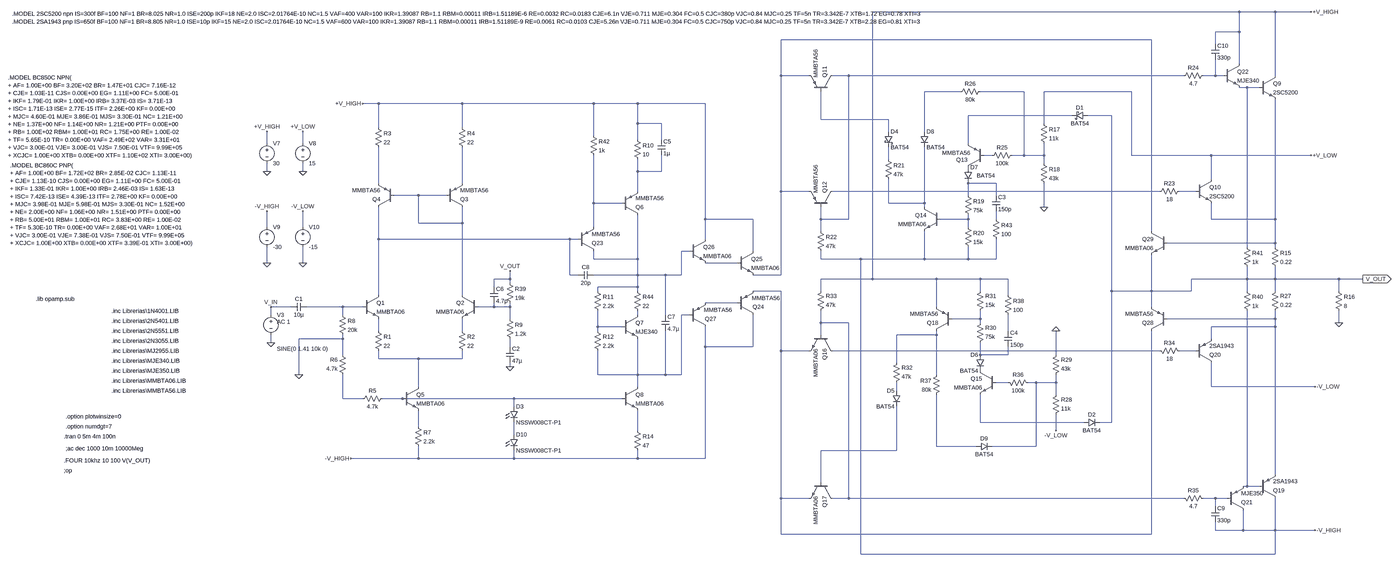
[diagram p0: schematic TPdisenio esquematico.asc, whole sheet]
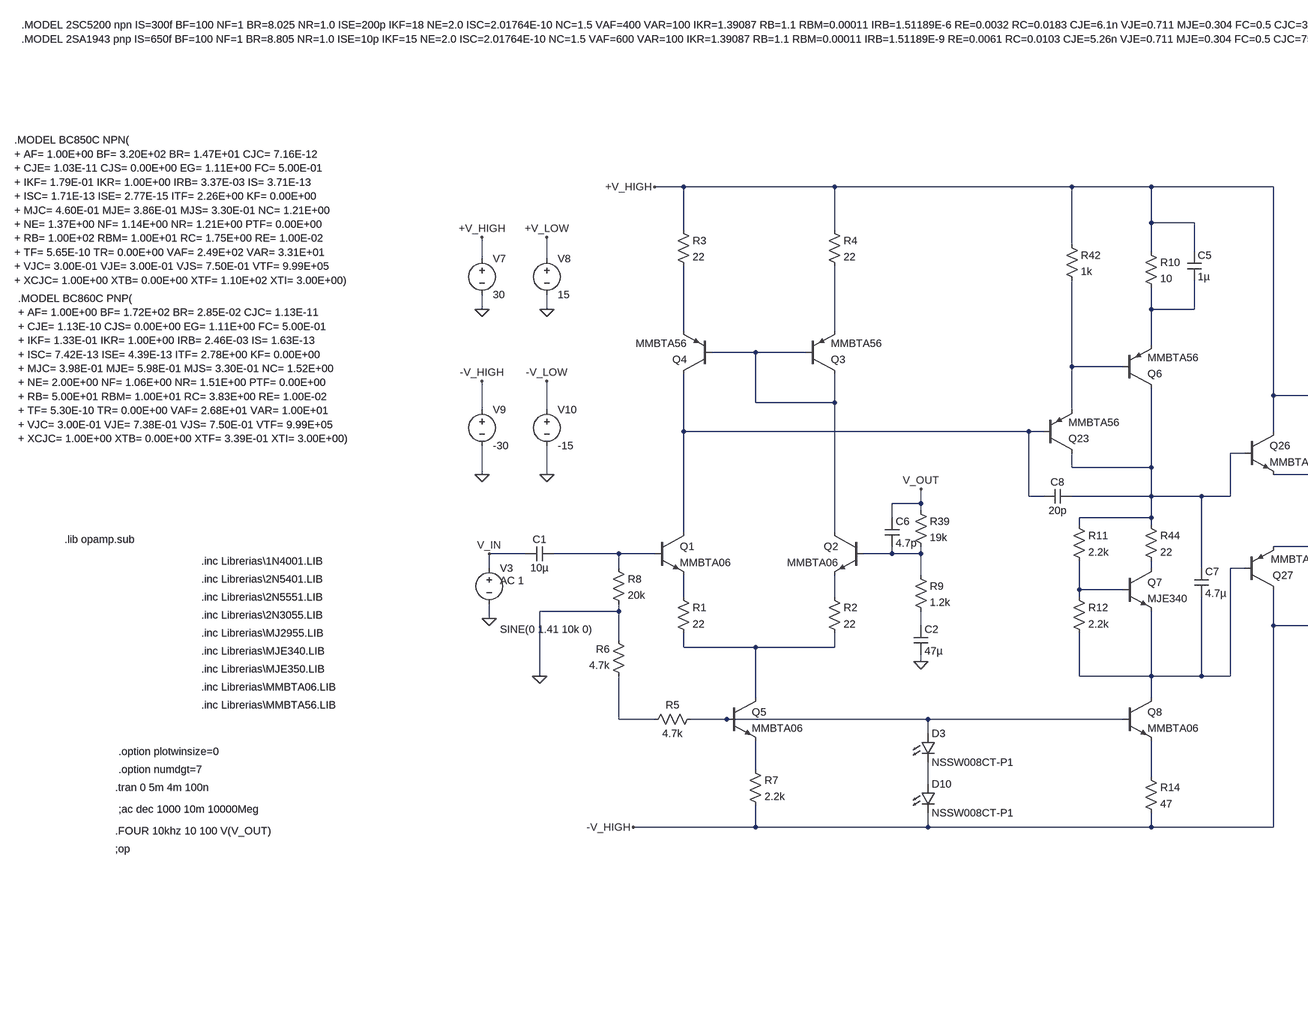
[diagram p1: schematic TPdisenio esquematico.asc, part, row 1 of 1, column 1 of 2]
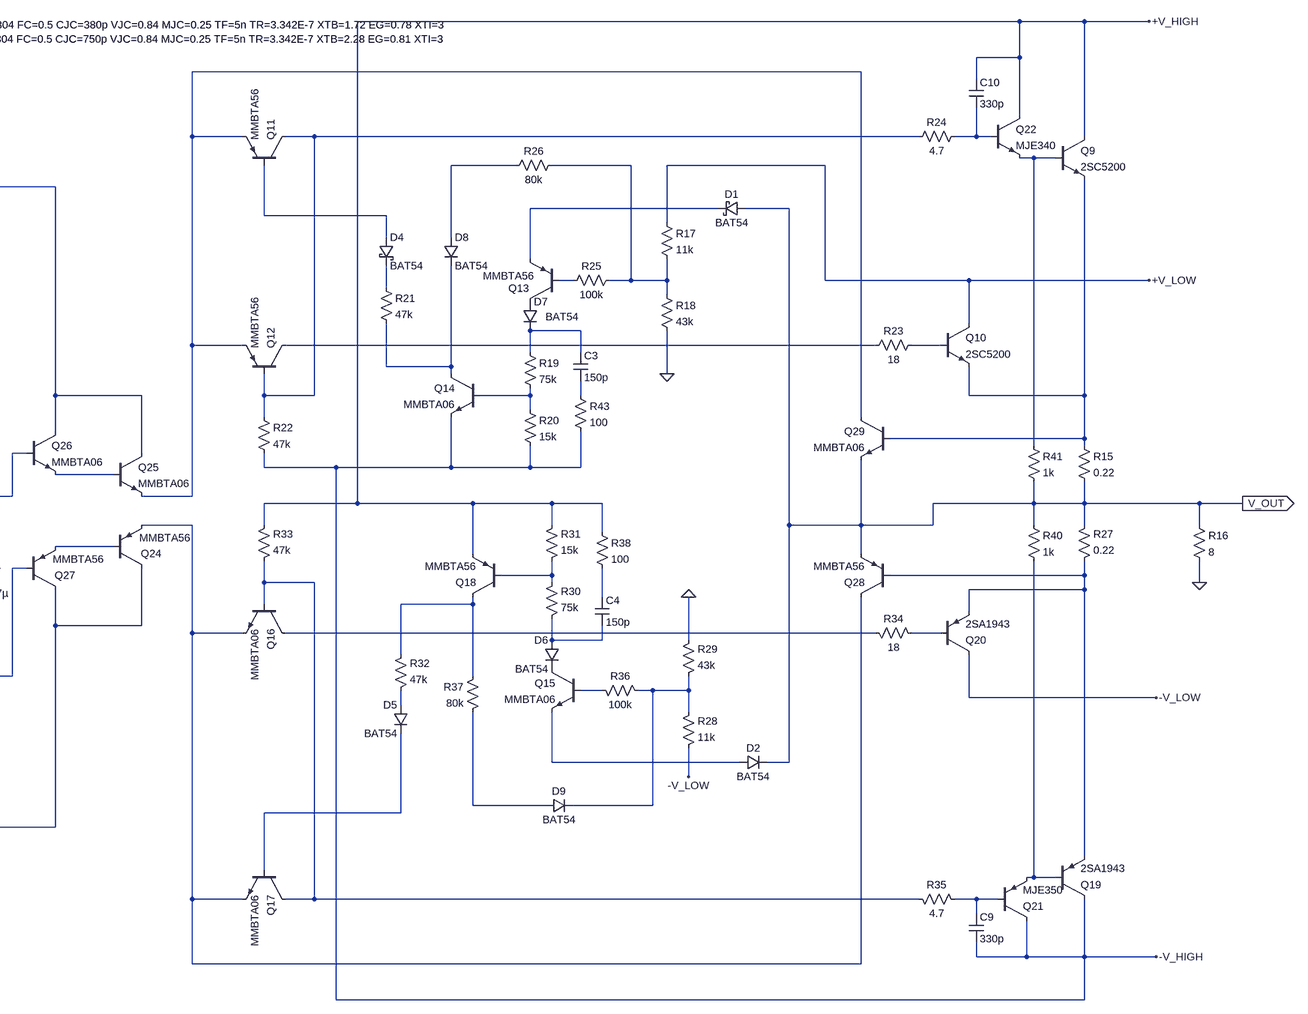
[diagram p2: schematic TPdisenio esquematico.asc, part, row 1 of 1, column 2 of 2]
TPdisenio esquematico.asc, the LTspice schematic file:
Version 4
SHEET 1 5784 2796
WIRE 3728 -992 2256 -992
WIRE 3872 -992 3728 -992
WIRE 4016 -992 3872 -992
WIRE 3728 -912 3728 -992
WIRE 3728 -912 3632 -912
WIRE 3376 -880 1888 -880
WIRE 3632 -864 3632 -912
WIRE 3728 -784 3728 -912
WIRE 1888 -736 1888 -880
WIRE 2000 -736 1888 -736
WIRE 2160 -736 2096 -736
WIRE 3504 -736 2160 -736
WIRE 3632 -736 3632 -800
WIRE 3632 -736 3584 -736
WIRE 3664 -736 3632 -736
WIRE 3872 -736 3872 -992
WIRE 3760 -688 3728 -688
WIRE 3808 -688 3760 -688
WIRE 2608 -672 2464 -672
WIRE 2864 -672 2688 -672
WIRE 3296 -672 2944 -672
WIRE 272 -624 208 -624
WIRE 608 -624 272 -624
WIRE 1136 -624 608 -624
WIRE 1312 -624 1136 -624
WIRE 1584 -624 1312 -624
WIRE 3056 -576 2640 -576
WIRE 3216 -576 3120 -576
WIRE 2048 -560 2048 -672
WIRE 2320 -560 2048 -560
WIRE 1312 -544 1312 -624
WIRE 1408 -544 1312 -544
WIRE 2944 -544 2944 -672
WIRE 272 -528 272 -624
WIRE 608 -528 608 -624
WIRE 2320 -512 2320 -560
WIRE 2464 -512 2464 -672
WIRE 1136 -496 1136 -624
WIRE 1312 -480 1312 -544
WIRE 1408 -480 1408 -544
WIRE -176 -464 -176 -512
WIRE -32 -464 -32 -512
WIRE 2640 -464 2640 -576
WIRE 2736 -416 2704 -416
WIRE 2864 -416 2864 -672
WIRE 2864 -416 2816 -416
WIRE 2944 -416 2944 -464
WIRE 2944 -416 2864 -416
WIRE 3296 -416 3296 -672
WIRE 3616 -416 3296 -416
WIRE 4016 -416 3616 -416
WIRE 2320 -400 2320 -448
WIRE 2944 -384 2944 -416
WIRE -176 -352 -176 -384
WIRE -32 -352 -32 -384
WIRE 1312 -352 1312 -400
WIRE 1408 -352 1408 -416
WIRE 1408 -352 1312 -352
WIRE 3616 -320 3616 -416
WIRE 272 -304 272 -448
WIRE 608 -304 608 -448
WIRE 2752 -304 2640 -304
WIRE 1312 -272 1312 -352
WIRE 1888 -272 1888 -736
WIRE 2000 -272 1888 -272
WIRE 3408 -272 2096 -272
WIRE 3552 -272 3488 -272
WIRE 432 -256 336 -256
WIRE 544 -256 432 -256
WIRE 2640 -256 2640 -304
WIRE 2752 -256 2752 -304
WIRE 1136 -224 1136 -416
WIRE 1248 -224 1136 -224
WIRE 2320 -224 2320 -320
WIRE 2464 -224 2464 -448
WIRE 2464 -224 2320 -224
WIRE 2464 -208 2464 -224
WIRE 2944 -208 2944 -304
WIRE 1584 -160 1584 -624
WIRE 1776 -160 1584 -160
WIRE 2048 -160 2048 -208
WIRE 2160 -160 2160 -736
WIRE 2160 -160 2048 -160
WIRE 2640 -160 2640 -176
WIRE 2640 -160 2528 -160
WIRE 2752 -160 2752 -192
WIRE 3616 -160 3616 -224
WIRE 3872 -160 3872 -640
WIRE 3872 -160 3616 -160
WIRE 432 -144 432 -256
WIRE 608 -144 608 -208
WIRE 608 -144 432 -144
WIRE -176 -128 -176 -192
WIRE -32 -128 -32 -192
WIRE 1136 -128 1136 -224
WIRE 2640 -128 2640 -160
WIRE 2048 -112 2048 -160
WIRE 3376 -112 3376 -880
WIRE 272 -80 272 -208
WIRE 1040 -80 272 -80
WIRE 1072 -80 1040 -80
WIRE 1584 -80 1584 -160
WIRE 3872 -64 3872 -160
WIRE 3872 -64 3440 -64
WIRE 3760 -48 3760 -688
WIRE 3872 -48 3872 -64
WIRE 1520 -32 1488 -32
WIRE 1776 -32 1776 -160
WIRE 1136 0 1136 -32
WIRE 1312 0 1312 -176
WIRE 1312 0 1136 0
WIRE 2048 0 2048 -32
WIRE 2208 0 2048 0
WIRE 2464 0 2464 -112
WIRE 2464 0 2208 0
WIRE 2640 0 2640 -48
WIRE 2640 0 2464 0
WIRE 2752 0 2752 -80
WIRE 2752 0 2640 0
WIRE -176 16 -176 -48
WIRE -32 16 -32 -48
WIRE 1712 16 1584 16
WIRE 1040 64 1040 -80
WIRE 1072 64 1040 64
WIRE 1312 64 1312 0
WIRE 1312 64 1136 64
WIRE 1424 64 1312 64
WIRE 1488 64 1488 -32
WIRE 1488 64 1424 64
WIRE 1888 64 1888 -272
WIRE 1888 64 1776 64
WIRE 800 80 800 48
WIRE 800 80 736 80
WIRE 2256 80 2256 -992
WIRE 2256 80 2048 80
WIRE 2512 80 2256 80
WIRE 2688 80 2512 80
WIRE 2800 80 2688 80
WIRE 3760 80 3760 32
WIRE 3760 80 3536 80
WIRE 3872 80 3872 32
WIRE 3872 80 3760 80
WIRE 4128 80 3872 80
WIRE 4224 80 4128 80
WIRE 800 96 800 80
WIRE 736 112 736 80
WIRE 1312 112 1312 64
WIRE 1312 112 1152 112
WIRE 1152 128 1152 112
WIRE 1312 128 1312 112
WIRE 1888 128 1776 128
WIRE 2048 128 2048 80
WIRE 2688 128 2688 80
WIRE 3216 128 3216 -576
WIRE 3376 128 3376 -16
WIRE 3376 128 3216 128
WIRE 3536 128 3536 80
WIRE 3536 128 3376 128
WIRE 3760 128 3760 80
WIRE 3872 128 3872 80
WIRE 4128 128 4128 80
WIRE 272 144 272 -80
WIRE 608 144 608 -144
WIRE 2800 144 2800 80
WIRE 1712 176 1584 176
WIRE -80 192 -160 192
WIRE 128 192 -16 192
WIRE 208 192 128 192
WIRE 736 192 736 176
WIRE 736 192 672 192
WIRE 800 192 800 176
WIRE 800 192 736 192
WIRE 2512 192 2512 80
WIRE 3376 192 3376 128
WIRE -160 224 -160 192
WIRE 128 224 128 192
WIRE 1312 224 1312 208
WIRE 1424 224 1424 64
WIRE 1520 224 1488 224
WIRE 800 240 800 192
WIRE 2688 240 2688 208
WIRE 2688 240 2576 240
WIRE 3872 240 3872 208
WIRE 3872 240 3440 240
WIRE 2048 256 2048 208
WIRE 2160 256 2048 256
WIRE 2688 256 2688 240
WIRE 4128 256 4128 208
WIRE 1152 272 1152 208
WIRE 1248 272 1152 272
WIRE 3872 272 3872 240
WIRE 3872 272 3616 272
WIRE 272 288 272 240
WIRE 608 288 608 240
WIRE 1152 288 1152 272
WIRE 2800 288 2800 224
WIRE 2048 304 2048 256
WIRE 2512 304 2512 288
WIRE 2512 304 2352 304
WIRE 128 320 128 304
WIRE 128 320 -48 320
WIRE 3616 320 3616 272
WIRE -160 336 -160 304
WIRE 800 352 800 320
WIRE 1584 352 1584 272
WIRE 1776 352 1776 224
WIRE 1776 352 1584 352
WIRE 1888 368 1888 128
WIRE 2000 368 1888 368
WIRE 3408 368 2096 368
WIRE 3552 368 3488 368
WIRE 128 384 128 320
WIRE 2688 384 2688 336
WIRE 2800 384 2800 352
WIRE 2800 384 2688 384
WIRE 2992 384 2992 288
WIRE 272 400 272 368
WIRE 432 400 272 400
WIRE 608 400 608 368
WIRE 608 400 432 400
WIRE 2352 416 2352 304
WIRE 800 432 800 416
WIRE -48 464 -48 320
WIRE 1152 464 1152 368
WIRE 1312 464 1312 320
WIRE 1312 464 1152 464
WIRE 1424 464 1424 288
WIRE 1424 464 1312 464
WIRE 1488 464 1488 224
WIRE 1488 464 1424 464
WIRE 2512 464 2512 304
WIRE 2800 496 2752 496
WIRE 2912 496 2880 496
WIRE 2992 496 2992 464
WIRE 2992 496 2912 496
WIRE 432 512 432 400
WIRE 1312 512 1312 464
WIRE 3616 512 3616 416
WIRE 4032 512 3616 512
WIRE 2352 528 2352 496
WIRE 2992 544 2992 496
WIRE 128 560 128 464
WIRE 208 560 128 560
WIRE 368 560 288 560
WIRE 816 560 368 560
WIRE 1248 560 816 560
WIRE 816 592 816 560
WIRE 2688 656 2688 544
WIRE 3104 656 2688 656
WIRE 3216 656 3216 128
WIRE 3216 656 3168 656
WIRE 432 672 432 608
WIRE 1312 688 1312 608
WIRE 2992 688 2992 624
WIRE 816 704 816 656
WIRE 2512 752 2512 544
WIRE 2672 752 2512 752
WIRE 2912 752 2912 496
WIRE 2912 752 2736 752
WIRE 2352 768 2352 592
WIRE 2352 768 2048 768
WIRE 432 800 432 752
WIRE 432 800 160 800
WIRE 816 800 816 768
WIRE 816 800 432 800
WIRE 1312 800 1312 768
WIRE 1312 800 816 800
WIRE 1584 800 1584 352
WIRE 1584 800 1312 800
WIRE 3872 864 3872 272
WIRE 2048 896 2048 768
WIRE 3760 912 3760 208
WIRE 3760 912 3744 912
WIRE 3808 912 3760 912
WIRE 1888 960 1888 368
WIRE 2000 960 1888 960
WIRE 2160 960 2160 256
WIRE 2160 960 2096 960
WIRE 3504 960 2160 960
WIRE 3632 960 3584 960
WIRE 3680 960 3632 960
WIRE 3632 992 3632 960
WIRE 3632 1088 3632 1056
WIRE 3744 1088 3744 1008
WIRE 3744 1088 3632 1088
WIRE 3872 1088 3872 960
WIRE 3872 1088 3744 1088
WIRE 4032 1088 3872 1088
WIRE 1888 1104 1888 960
WIRE 3376 1104 3376 288
WIRE 3376 1104 1888 1104
WIRE 2208 1184 2208 0
WIRE 3872 1184 3872 1088
WIRE 3872 1184 2208 1184
FLAG -48 464 0
FLAG 800 432 0
FLAG -160 336 0
FLAG 4016 -992 +V_HIGH
FLAG 4016 -416 +V_LOW
FLAG 4128 256 0
FLAG 2944 -208 0
FLAG 4224 80 V_OUT
IOPIN 4224 80 Out
FLAG 4032 1088 -V_HIGH
FLAG 4032 512 -V_LOW
FLAG 2992 288 0
FLAG 2992 688 -V_LOW
FLAG -176 -352 0
FLAG -32 -352 0
FLAG -176 -512 +V_HIGH
FLAG -32 -512 +V_LOW
FLAG -176 16 0
FLAG -32 16 0
FLAG -176 -192 -V_HIGH
FLAG -32 -192 -V_LOW
FLAG 208 -624 +V_HIGH
FLAG 160 800 -V_HIGH
FLAG 800 48 V_OUT
FLAG -160 192 V_IN
SYMBOL npn 208 144 R0
SYMATTR InstName Q1
SYMATTR Value MMBTA06
SYMBOL npn 672 144 M0
SYMATTR InstName Q2
SYMATTR Value MMBTA06
SYMBOL pnp 544 -208 M180
SYMATTR InstName Q3
SYMATTR Value MMBTA56
SYMBOL pnp 336 -208 R180
SYMATTR InstName Q4
SYMATTR Value MMBTA56
SYMBOL res 256 272 R0
SYMATTR InstName R1
SYMATTR Value 22
SYMBOL res 592 272 R0
SYMATTR InstName R2
SYMATTR Value 22
SYMBOL res 256 -544 R0
SYMATTR InstName R3
SYMATTR Value 22
SYMBOL res 592 -544 R0
SYMATTR InstName R4
SYMATTR Value 22
SYMBOL npn 368 512 R0
SYMATTR InstName Q5
SYMATTR Value MMBTA06
SYMBOL res 304 544 R90
WINDOW 0 0 56 VBottom 2
WINDOW 3 32 56 VTop 2
SYMATTR InstName R5
SYMATTR Value 4.7k
SYMBOL res 144 480 R180
WINDOW 0 36 76 Left 2
WINDOW 3 36 40 Left 2
SYMATTR InstName R6
SYMATTR Value 4.7k
SYMBOL res 416 656 R0
SYMATTR InstName R7
SYMATTR Value 2.2k
SYMBOL res 112 208 R0
SYMATTR InstName R8
SYMATTR Value 20k
SYMBOL res 784 224 R0
SYMATTR InstName R9
SYMATTR Value 1.2k
SYMBOL cap -16 176 R90
WINDOW 0 0 32 VBottom 2
WINDOW 3 32 32 VTop 2
SYMATTR InstName C1
SYMATTR Value 10µ
SYMBOL voltage -160 208 R0
WINDOW 3 24 152 Left 2
WINDOW 123 24 44 Left 2
WINDOW 39 0 0 Left 0
SYMATTR Value SINE(0 1.41 10k 0)
SYMATTR Value2 AC 1
SYMATTR InstName V3
SYMBOL pnp 1248 -176 M180
SYMATTR InstName Q6
SYMATTR Value MMBTA56
SYMBOL res 1296 -496 R0
SYMATTR InstName R10
SYMATTR Value 10
SYMBOL npn 1248 224 R0
SYMATTR InstName Q7
SYMATTR Value MJE340
SYMBOL res 1136 112 R0
SYMATTR InstName R11
SYMATTR Value 2.2k
SYMBOL res 1136 272 R0
SYMATTR InstName R12
SYMATTR Value 2.2k
SYMBOL npn 1248 512 R0
SYMATTR InstName Q8
SYMATTR Value MMBTA06
SYMBOL res 1296 672 R0
SYMATTR InstName R14
SYMATTR Value 47
SYMBOL cap 784 352 R0
SYMATTR InstName C2
SYMATTR Value 47µ
SYMBOL npn 3808 -736 R0
SYMATTR InstName Q9
SYMATTR Value 2SC5200
SYMBOL npn 3552 -320 R0
SYMATTR InstName Q10
SYMATTR Value 2SC5200
SYMBOL res 3856 -64 R0
SYMATTR InstName R15
SYMATTR Value 0.22
SYMBOL pnp 2096 -672 M270
SYMATTR InstName Q11
SYMATTR Value MMBTA56
SYMBOL pnp 2096 -208 M270
SYMATTR InstName Q12
SYMATTR Value MMBTA56
SYMBOL res 4112 112 R0
SYMATTR InstName R16
SYMATTR Value 8
SYMBOL res 2928 -560 R0
SYMATTR InstName R17
SYMATTR Value 11k
SYMBOL res 2928 -400 R0
SYMATTR InstName R18
SYMATTR Value 43k
SYMBOL pnp 2704 -368 R180
WINDOW 0 67 30 Left 2
WINDOW 3 55 58 Left 2
SYMATTR InstName Q13
SYMATTR Value MMBTA56
SYMBOL res 2624 -272 R0
SYMATTR InstName R19
SYMATTR Value 75k
SYMBOL res 2624 -144 R0
SYMATTR InstName R20
SYMATTR Value 15k
SYMBOL npn 2528 -208 M0
SYMATTR InstName Q14
SYMATTR Value MMBTA06
SYMBOL res 2304 -416 R0
SYMATTR InstName R21
SYMATTR Value 47k
SYMBOL res 2032 -128 R0
SYMATTR InstName R22
SYMATTR Value 47k
SYMBOL cap 2736 -256 R0
SYMATTR InstName C3
SYMATTR Value 150p
SYMBOL schottky 3120 -592 R90
WINDOW 0 0 32 VBottom 2
WINDOW 3 32 32 VTop 2
SYMATTR InstName D1
SYMATTR Value BAT54
SYMATTR Description Diode
SYMATTR Type diode
SYMBOL res 3504 -288 R90
WINDOW 0 0 56 VBottom 2
WINDOW 3 32 56 VTop 2
SYMATTR InstName R23
SYMATTR Value 18
SYMBOL res 3600 -752 R90
WINDOW 0 0 56 VBottom 2
WINDOW 3 32 56 VTop 2
SYMATTR InstName R24
SYMATTR Value 4.7
SYMBOL res 2832 -432 R90
WINDOW 0 0 56 VBottom 2
WINDOW 3 32 56 VTop 2
SYMATTR InstName R25
SYMATTR Value 100k
SYMBOL res 2704 -688 R90
WINDOW 0 0 56 VBottom 2
WINDOW 3 32 56 VTop 2
SYMATTR InstName R26
SYMATTR Value 80k
SYMBOL res 3856 224 M180
WINDOW 0 36 76 Left 2
WINDOW 3 36 40 Left 2
SYMATTR InstName R27
SYMATTR Value 0.22
SYMBOL res 2976 640 M180
WINDOW 0 36 76 Left 2
WINDOW 3 36 40 Left 2
SYMATTR InstName R28
SYMATTR Value 11k
SYMBOL res 2976 480 M180
WINDOW 0 36 76 Left 2
WINDOW 3 36 40 Left 2
SYMATTR InstName R29
SYMATTR Value 43k
SYMBOL res 2672 352 M180
WINDOW 0 36 76 Left 2
WINDOW 3 36 40 Left 2
SYMATTR InstName R30
SYMATTR Value 75k
SYMBOL res 2672 224 M180
WINDOW 0 36 76 Left 2
WINDOW 3 36 40 Left 2
SYMATTR InstName R31
SYMATTR Value 15k
SYMBOL res 2336 512 M180
WINDOW 0 36 76 Left 2
WINDOW 3 36 40 Left 2
SYMATTR InstName R32
SYMATTR Value 47k
SYMBOL res 2032 224 M180
WINDOW 0 36 76 Left 2
WINDOW 3 36 40 Left 2
SYMATTR InstName R33
SYMATTR Value 47k
SYMBOL cap 2784 352 M180
WINDOW 0 24 56 Left 2
WINDOW 3 24 8 Left 2
SYMATTR InstName C4
SYMATTR Value 150p
SYMBOL diode 3104 640 M90
WINDOW 0 0 32 VBottom 2
WINDOW 3 32 32 VTop 2
SYMATTR InstName D2
SYMATTR Value BAT54
SYMBOL res 3504 384 M270
WINDOW 0 32 56 VTop 2
WINDOW 3 0 56 VBottom 2
SYMATTR InstName R34
SYMATTR Value 18
SYMBOL res 3600 976 M270
WINDOW 0 32 56 VTop 2
WINDOW 3 0 56 VBottom 2
SYMATTR InstName R35
SYMATTR Value 4.7
SYMBOL res 2896 512 M270
WINDOW 0 32 56 VTop 2
WINDOW 3 0 56 VBottom 2
SYMATTR InstName R36
SYMATTR Value 100k
SYMBOL res 2528 448 M0
SYMATTR InstName R37
SYMATTR Value 80k
SYMBOL npn 2752 448 M0
SYMATTR InstName Q15
SYMATTR Value MMBTA06
SYMBOL npn 2096 304 R90
SYMATTR InstName Q16
SYMATTR Value MMBTA06
SYMBOL npn 2096 896 R90
SYMATTR InstName Q17
SYMATTR Value MMBTA06
SYMBOL pnp 2576 288 R180
SYMATTR InstName Q18
SYMATTR Value MMBTA56
SYMBOL pnp 3808 960 M180
SYMATTR InstName Q19
SYMATTR Value 2SA1943
SYMBOL pnp 3552 416 M180
SYMATTR InstName Q20
SYMATTR Value 2SA1943
SYMBOL voltage -176 -480 R0
WINDOW 123 0 0 Left 0
WINDOW 39 0 0 Left 0
SYMATTR InstName V7
SYMATTR Value 30
SYMBOL voltage -32 -480 R0
WINDOW 123 0 0 Left 0
WINDOW 39 0 0 Left 0
SYMATTR InstName V8
SYMATTR Value 15
SYMBOL voltage -176 -144 R0
WINDOW 123 0 0 Left 0
WINDOW 39 0 0 Left 0
SYMATTR InstName V9
SYMATTR Value -30
SYMBOL voltage -32 -144 R0
WINDOW 123 0 0 Left 0
WINDOW 39 0 0 Left 0
SYMATTR InstName V10
SYMATTR Value -15
SYMBOL res 784 80 R0
SYMATTR InstName R39
SYMATTR Value 19k
SYMBOL LED 800 592 R0
SYMATTR InstName D3
SYMATTR Value NSSW008CT-P1
SYMBOL cap 1392 -480 R0
SYMATTR InstName C5
SYMATTR Value 1µ
SYMBOL pnp 3680 1008 M180
SYMATTR InstName Q21
SYMATTR Value MJE350
SYMBOL res 3744 112 R0
SYMATTR InstName R40
SYMATTR Value 1k
SYMBOL npn 3664 -784 R0
SYMATTR InstName Q22
SYMATTR Value MJE340
SYMBOL res 3744 -64 R0
SYMATTR InstName R41
SYMATTR Value 1k
SYMBOL cap 720 112 R0
SYMATTR InstName C6
SYMATTR Value 4.7p
SYMBOL pnp 1072 -32 M180
SYMATTR InstName Q23
SYMATTR Value MMBTA56
SYMBOL res 1120 -512 R0
SYMATTR InstName R42
SYMATTR Value 1k
SYMBOL cap 1136 48 R90
WINDOW 0 0 32 VBottom 2
WINDOW 3 32 32 VTop 2
SYMATTR InstName C8
SYMATTR Value 20p
SYMBOL cap 1408 224 R0
SYMATTR InstName C7
SYMATTR Value 4.7µ
SYMBOL schottky 2304 -512 R0
SYMATTR InstName D4
SYMATTR Value BAT54
SYMATTR Description Diode
SYMATTR Type diode
SYMBOL diode 2368 528 M0
SYMATTR InstName D5
SYMATTR Value BAT54
SYMBOL diode 2704 384 M0
SYMATTR InstName D6
SYMATTR Value BAT54
SYMBOL diode 2624 -368 R0
WINDOW 3 50 33 Left 2
SYMATTR Value BAT54
SYMATTR InstName D7
SYMBOL diode 2448 -512 R0
SYMATTR InstName D8
SYMATTR Value BAT54
SYMBOL diode 2672 736 M90
WINDOW 0 0 32 VBottom 2
WINDOW 3 32 32 VTop 2
SYMATTR InstName D9
SYMATTR Value BAT54
SYMBOL pnp 1712 224 M180
WINDOW 0 62 32 Left 2
WINDOW 3 59 67 Left 2
SYMATTR InstName Q24
SYMATTR Value MMBTA56
SYMBOL npn 1712 -32 R0
SYMATTR InstName Q25
SYMATTR Value MMBTA06
SYMBOL npn 1520 -80 R0
SYMATTR InstName Q26
SYMATTR Value MMBTA06
SYMBOL pnp 1520 272 M180
WINDOW 0 62 32 Left 2
WINDOW 3 58 68 Left 2
SYMATTR InstName Q27
SYMATTR Value MMBTA56
SYMBOL res 1296 112 R0
SYMATTR InstName R44
SYMATTR Value 22
SYMBOL pnp 3440 288 R180
SYMATTR InstName Q28
SYMATTR Value MMBTA56
SYMBOL npn 3440 -112 M0
SYMATTR InstName Q29
SYMATTR Value MMBTA06
SYMBOL res 2784 128 R0
SYMATTR InstName R38
SYMATTR Value 100
SYMBOL res 2736 -176 R0
SYMATTR InstName R43
SYMATTR Value 100
SYMBOL cap 3616 992 R0
SYMATTR InstName C9
SYMATTR Value 330p
SYMBOL cap 3616 -864 R0
SYMATTR InstName C10
SYMATTR Value 330p
SYMBOL LED 800 704 R0
SYMATTR InstName D10
SYMATTR Value NSSW008CT-P1
TEXT -992 712 Left 2 !.tran 0 5m 4m 100n
TEXT -992 808 Left 2 !.FOUR 10khz 10 100 V(V_OUT)
TEXT -1216 -728 Left 2 !.MODEL BC850C NPN(\n+ AF= 1.00E+00 BF= 3.20E+02 BR= 1.47E+01 CJC= 7.16E-12\n+ CJE= 1.03E-11 CJS= 0.00E+00 EG= 1.11E+00 FC= 5.00E-01\n+ IKF= 1.79E-01 IKR= 1.00E+00 IRB= 3.37E-03 IS= 3.71E-13\n+ ISC= 1.71E-13 ISE= 2.77E-15 ITF= 2.26E+00 KF= 0.00E+00\n+ MJC= 4.60E-01 MJE= 3.86E-01 MJS= 3.30E-01 NC= 1.21E+00\n+ NE= 1.37E+00 NF= 1.14E+00 NR= 1.21E+00 PTF= 0.00E+00\n+ RB= 1.00E+02 RBM= 1.00E+01 RC= 1.75E+00 RE= 1.00E-02\n+ TF= 5.65E-10 TR= 0.00E+00 VAF= 2.49E+02 VAR= 3.31E+01\n+ VJC= 3.00E-01 VJE= 3.00E-01 VJS= 7.50E-01 VTF= 9.99E+05\n+ XCJC= 1.00E+00 XTB= 0.00E+00 XTF= 1.10E+02 XTI= 3.00E+00)
TEXT -1208 -376 Left 2 !.MODEL BC860C PNP(\n+ AF= 1.00E+00 BF= 1.72E+02 BR= 2.85E-02 CJC= 1.13E-11\n+ CJE= 1.13E-10 CJS= 0.00E+00 EG= 1.11E+00 FC= 5.00E-01\n+ IKF= 1.33E-01 IKR= 1.00E+00 IRB= 2.46E-03 IS= 1.63E-13\n+ ISC= 7.42E-13 ISE= 4.39E-13 ITF= 2.78E+00 KF= 0.00E+00\n+ MJC= 3.98E-01 MJE= 5.98E-01 MJS= 3.30E-01 NC= 1.52E+00\n+ NE= 2.00E+00 NF= 1.06E+00 NR= 1.51E+00 PTF= 0.00E+00\n+ RB= 5.00E+01 RBM= 1.00E+01 RC= 3.83E+00 RE= 1.00E-02\n+ TF= 5.30E-10 TR= 0.00E+00 VAF= 2.68E+01 VAR= 1.00E+01\n+ VJC= 3.00E-01 VJE= 7.38E-01 VJS= 7.50E-01 VTF= 9.99E+05\n+ XCJC= 1.00E+00 XTB= 0.00E+00 XTF= 3.39E-01 XTI= 3.00E+00)
TEXT -1104 160 Left 2 !.lib opamp.sub
TEXT -984 760 Left 2 !;ac dec 1000 10m 10000Meg
TEXT -992 848 Left 2 !;op
TEXT -984 672 Left 2 !.option numdgt=7
TEXT -984 632 Left 2 !.option plotwinsize=0
TEXT -1200 -984 Left 2 !.MODEL 2SC5200 npn IS=300f BF=100 NF=1 BR=8.025 NR=1.0 ISE=200p IKF=18 NE=2.0 ISC=2.01764E-10 NC=1.5 VAF=400 VAR=100 IKR=1.39087 RB=1.1 RBM=0.00011 IRB=1.51189E-6 RE=0.0032 RC=0.0183 CJE=6.1n VJE=0.711 MJE=0.304 FC=0.5 CJC=380p VJC=0.84 MJC=0.25 TF=5n TR=3.342E-7 XTB=1.72 EG=0.78 XTI=3\n.MODEL 2SA1943 pnp IS=650f BF=100 NF=1 BR=8.805 NR=1.0 ISE=10p IKF=15 NE=2.0 ISC=2.01764E-10 NC=1.5 VAF=600 VAR=100 IKR=1.39087 RB=1.1 RBM=0.00011 IRB=1.51189E-9 RE=0.0061 RC=0.0103 CJE=5.26n VJE=0.711 MJE=0.304 FC=0.5 CJC=750p VJC=0.84 MJC=0.25 TF=5n TR=3.342E-7 XTB=2.28 EG=0.81 XTI=3
TEXT -800 368 Left 2 !.inc Librerias\\MJ2955.LIB
TEXT -800 328 Left 2 !.inc Librerias\\2N3055.LIB
TEXT -800 288 Left 2 !.inc Librerias\\2N5551.LIB
TEXT -800 248 Left 2 !.inc Librerias\\2N5401.LIB
TEXT -800 208 Left 2 !.inc Librerias\\1N4001.LIB
TEXT -800 408 Left 2 !.inc Librerias\\MJE340.LIB
TEXT -800 448 Left 2 !.inc Librerias\\MJE350.LIB
TEXT -800 488 Left 2 !.inc Librerias\\MMBTA06.LIB
TEXT -800 528 Left 2 !.inc Librerias\\MMBTA56.LIB

The netlist it stands for:
* TPdisenio esquematico.asc
Q1 N023 N028 N036 0 MMBTA06
Q2 N017 N029 N037 0 MMBTA06
Q3 N017 N017 N013 0 MMBTA56
Q4 N023 N017 N012 0 MMBTA56
R1 N036 N044 22
R2 N037 N044 22
R3 +V_HIGH N012 22
R4 +V_HIGH N013 22
Q5 N044 N049 N051 0 MMBTA06
R5 N049 N048 4.7k
R6 N048 0 4.7k
R7 N051 -V_HIGH 2.2k
R8 N028 0 20k
R9 N029 N040 1.2k
C1 N028 V_IN 10µ
V3 V_IN 0 SINE(0 1.41 10k 0) AC 1
Q6 N024 N018 N011 0 MMBTA56
R10 +V_HIGH N011 10
Q7 N030 N035 N031 0 MJE340
R11 N024 N035 2.2k
R12 N035 N031 2.2k
Q8 N031 N049 N052 0 MMBTA06
R14 N052 -V_HIGH 47
C2 N040 0 47µ
Q9 +V_HIGH N004 N022 0 2SC5200
Q10 +V_LOW N016 N022 0 2SC5200
R15 N022 V_OUT 0.22
Q11 N002 N008 N001 0 MMBTA56
Q12 N015 N002 N001 0 MMBTA56
R16 V_OUT 0 8
R17 +V_LOW N006 11k
R18 N006 0 43k
Q13 P001 N009 N007 0 MMBTA56
R19 N014 N020 75k
R20 N020 -V_HIGH 15k
Q14 N019 N020 -V_HIGH 0 MMBTA06
R21 N010 N019 47k
R22 N002 -V_HIGH 47k
C3 N014 N021 150p
D1 V_OUT N007 BAT54
R23 N016 N015 18
R24 N003 N002 4.7
R25 N006 N009 100k
R26 N006 N005 80k
R27 N033 V_OUT 0.22
R28 -V_LOW N046 11k
R29 N046 0 43k
R30 N043 N032 75k
R31 N032 +V_HIGH 15k
R32 N047 N039 47k
R33 N034 +V_HIGH 47k
C4 N043 N038 150p
D2 N050 V_OUT BAT54
R34 N042 N041 18
R35 N057 N034 4.7
R36 N046 N045 100k
R37 N039 N054 80k
Q15 P002 N045 N050 0 MMBTA06
Q16 N041 N034 N026 0 MMBTA06
Q17 N034 N055 N026 0 MMBTA06
Q18 N039 N032 +V_HIGH 0 MMBTA56
Q19 -V_HIGH N056 N033 0 2SA1943
Q20 -V_LOW N042 N033 0 2SA1943
V7 +V_HIGH 0 30
V8 +V_LOW 0 15
V9 -V_HIGH 0 -30
V10 -V_LOW 0 -15
R39 V_OUT N029 19k
D3 N049 N053 NSSW008CT-P1
C5 +V_HIGH N011 1µ
Q21 -V_HIGH N057 N056 0 MJE350
R40 V_OUT N056 1k
Q22 +V_HIGH N003 N004 0 MJE340
R41 N004 V_OUT 1k
C6 V_OUT N029 4.7p
Q23 N024 N023 N018 0 MMBTA56
R42 +V_HIGH N018 1k
C8 N024 N023 20p
C7 N024 N031 4.7µ
D4 N008 N010 BAT54
D5 N047 N055 BAT54
D6 N043 P002 BAT54
D7 P001 N014 BAT54
D8 N005 N019 BAT54
D9 N054 N046 BAT54
Q24 -V_HIGH N027 N026 0 MMBTA56
Q25 +V_HIGH N025 N001 0 MMBTA06
Q26 +V_HIGH N024 N025 0 MMBTA06
Q27 -V_HIGH N031 N027 0 MMBTA56
R44 N024 N030 22
Q28 N026 N033 V_OUT 0 MMBTA56
Q29 N001 N022 V_OUT 0 MMBTA06
R38 +V_HIGH N038 100
R43 N021 -V_HIGH 100
C9 N057 -V_HIGH 330p
C10 +V_HIGH N003 330p
D10 N053 -V_HIGH NSSW008CT-P1
.model D D
.lib standard.dio
.model NPN NPN
.model PNP PNP
.lib standard.bjt
.tran 0 5m 4m 100n
.FOUR 10khz 10 100 V(V_OUT)
.MODEL BC850C NPN(
+ AF= 1.00E+00 BF= 3.20E+02 BR= 1.47E+01 CJC= 7.16E-12
+ CJE= 1.03E-11 CJS= 0.00E+00 EG= 1.11E+00 FC= 5.00E-01
+ IKF= 1.79E-01 IKR= 1.00E+00 IRB= 3.37E-03 IS= 3.71E-13
+ ISC= 1.71E-13 ISE= 2.77E-15 ITF= 2.26E+00 KF= 0.00E+00
+ MJC= 4.60E-01 MJE= 3.86E-01 MJS= 3.30E-01 NC= 1.21E+00
+ NE= 1.37E+00 NF= 1.14E+00 NR= 1.21E+00 PTF= 0.00E+00
+ RB= 1.00E+02 RBM= 1.00E+01 RC= 1.75E+00 RE= 1.00E-02
+ TF= 5.65E-10 TR= 0.00E+00 VAF= 2.49E+02 VAR= 3.31E+01
+ VJC= 3.00E-01 VJE= 3.00E-01 VJS= 7.50E-01 VTF= 9.99E+05
+ XCJC= 1.00E+00 XTB= 0.00E+00 XTF= 1.10E+02 XTI= 3.00E+00)
.MODEL BC860C PNP(
+ AF= 1.00E+00 BF= 1.72E+02 BR= 2.85E-02 CJC= 1.13E-11
+ CJE= 1.13E-10 CJS= 0.00E+00 EG= 1.11E+00 FC= 5.00E-01
+ IKF= 1.33E-01 IKR= 1.00E+00 IRB= 2.46E-03 IS= 1.63E-13
+ ISC= 7.42E-13 ISE= 4.39E-13 ITF= 2.78E+00 KF= 0.00E+00
+ MJC= 3.98E-01 MJE= 5.98E-01 MJS= 3.30E-01 NC= 1.52E+00
+ NE= 2.00E+00 NF= 1.06E+00 NR= 1.51E+00 PTF= 0.00E+00
+ RB= 5.00E+01 RBM= 1.00E+01 RC= 3.83E+00 RE= 1.00E-02
+ TF= 5.30E-10 TR= 0.00E+00 VAF= 2.68E+01 VAR= 1.00E+01
+ VJC= 3.00E-01 VJE= 7.38E-01 VJS= 7.50E-01 VTF= 9.99E+05
+ XCJC= 1.00E+00 XTB= 0.00E+00 XTF= 3.39E-01 XTI= 3.00E+00)
.lib opamp.sub
;ac dec 1000 10m 10000Meg
;op
.option numdgt=7
.option plotwinsize=0
.MODEL 2SC5200 npn IS=300f BF=100 NF=1 BR=8.025 NR=1.0 ISE=200p IKF=18 NE=2.0 ISC=2.01764E-10 NC=1.5 VAF=400 VAR=100 IKR=1.39087 RB=1.1 RBM=0.00011 IRB=1.51189E-6 RE=0.0032 RC=0.0183 CJE=6.1n VJE=0.711 MJE=0.304 FC=0.5 CJC=380p VJC=0.84 MJC=0.25 TF=5n TR=3.342E-7 XTB=1.72 EG=0.78 XTI=3
.MODEL 2SA1943 pnp IS=650f BF=100 NF=1 BR=8.805 NR=1.0 ISE=10p IKF=15 NE=2.0 ISC=2.01764E-10 NC=1.5 VAF=600 VAR=100 IKR=1.39087 RB=1.1 RBM=0.00011 IRB=1.51189E-9 RE=0.0061 RC=0.0103 CJE=5.26n VJE=0.711 MJE=0.304 FC=0.5 CJC=750p VJC=0.84 MJC=0.25 TF=5n TR=3.342E-7 XTB=2.28 EG=0.81 XTI=3
.inc Librerias\MJ2955.LIB
.inc Librerias\2N3055.LIB
.inc Librerias\2N5551.LIB
.inc Librerias\2N5401.LIB
.inc Librerias\1N4001.LIB
.inc Librerias\MJE340.LIB
.inc Librerias\MJE350.LIB
.inc Librerias\MMBTA06.LIB
.inc Librerias\MMBTA56.LIB
.backanno
.end